# EAGLE design WeMos-Matrix-Shield-DMA-buffer (EAGLE 7.7.0)
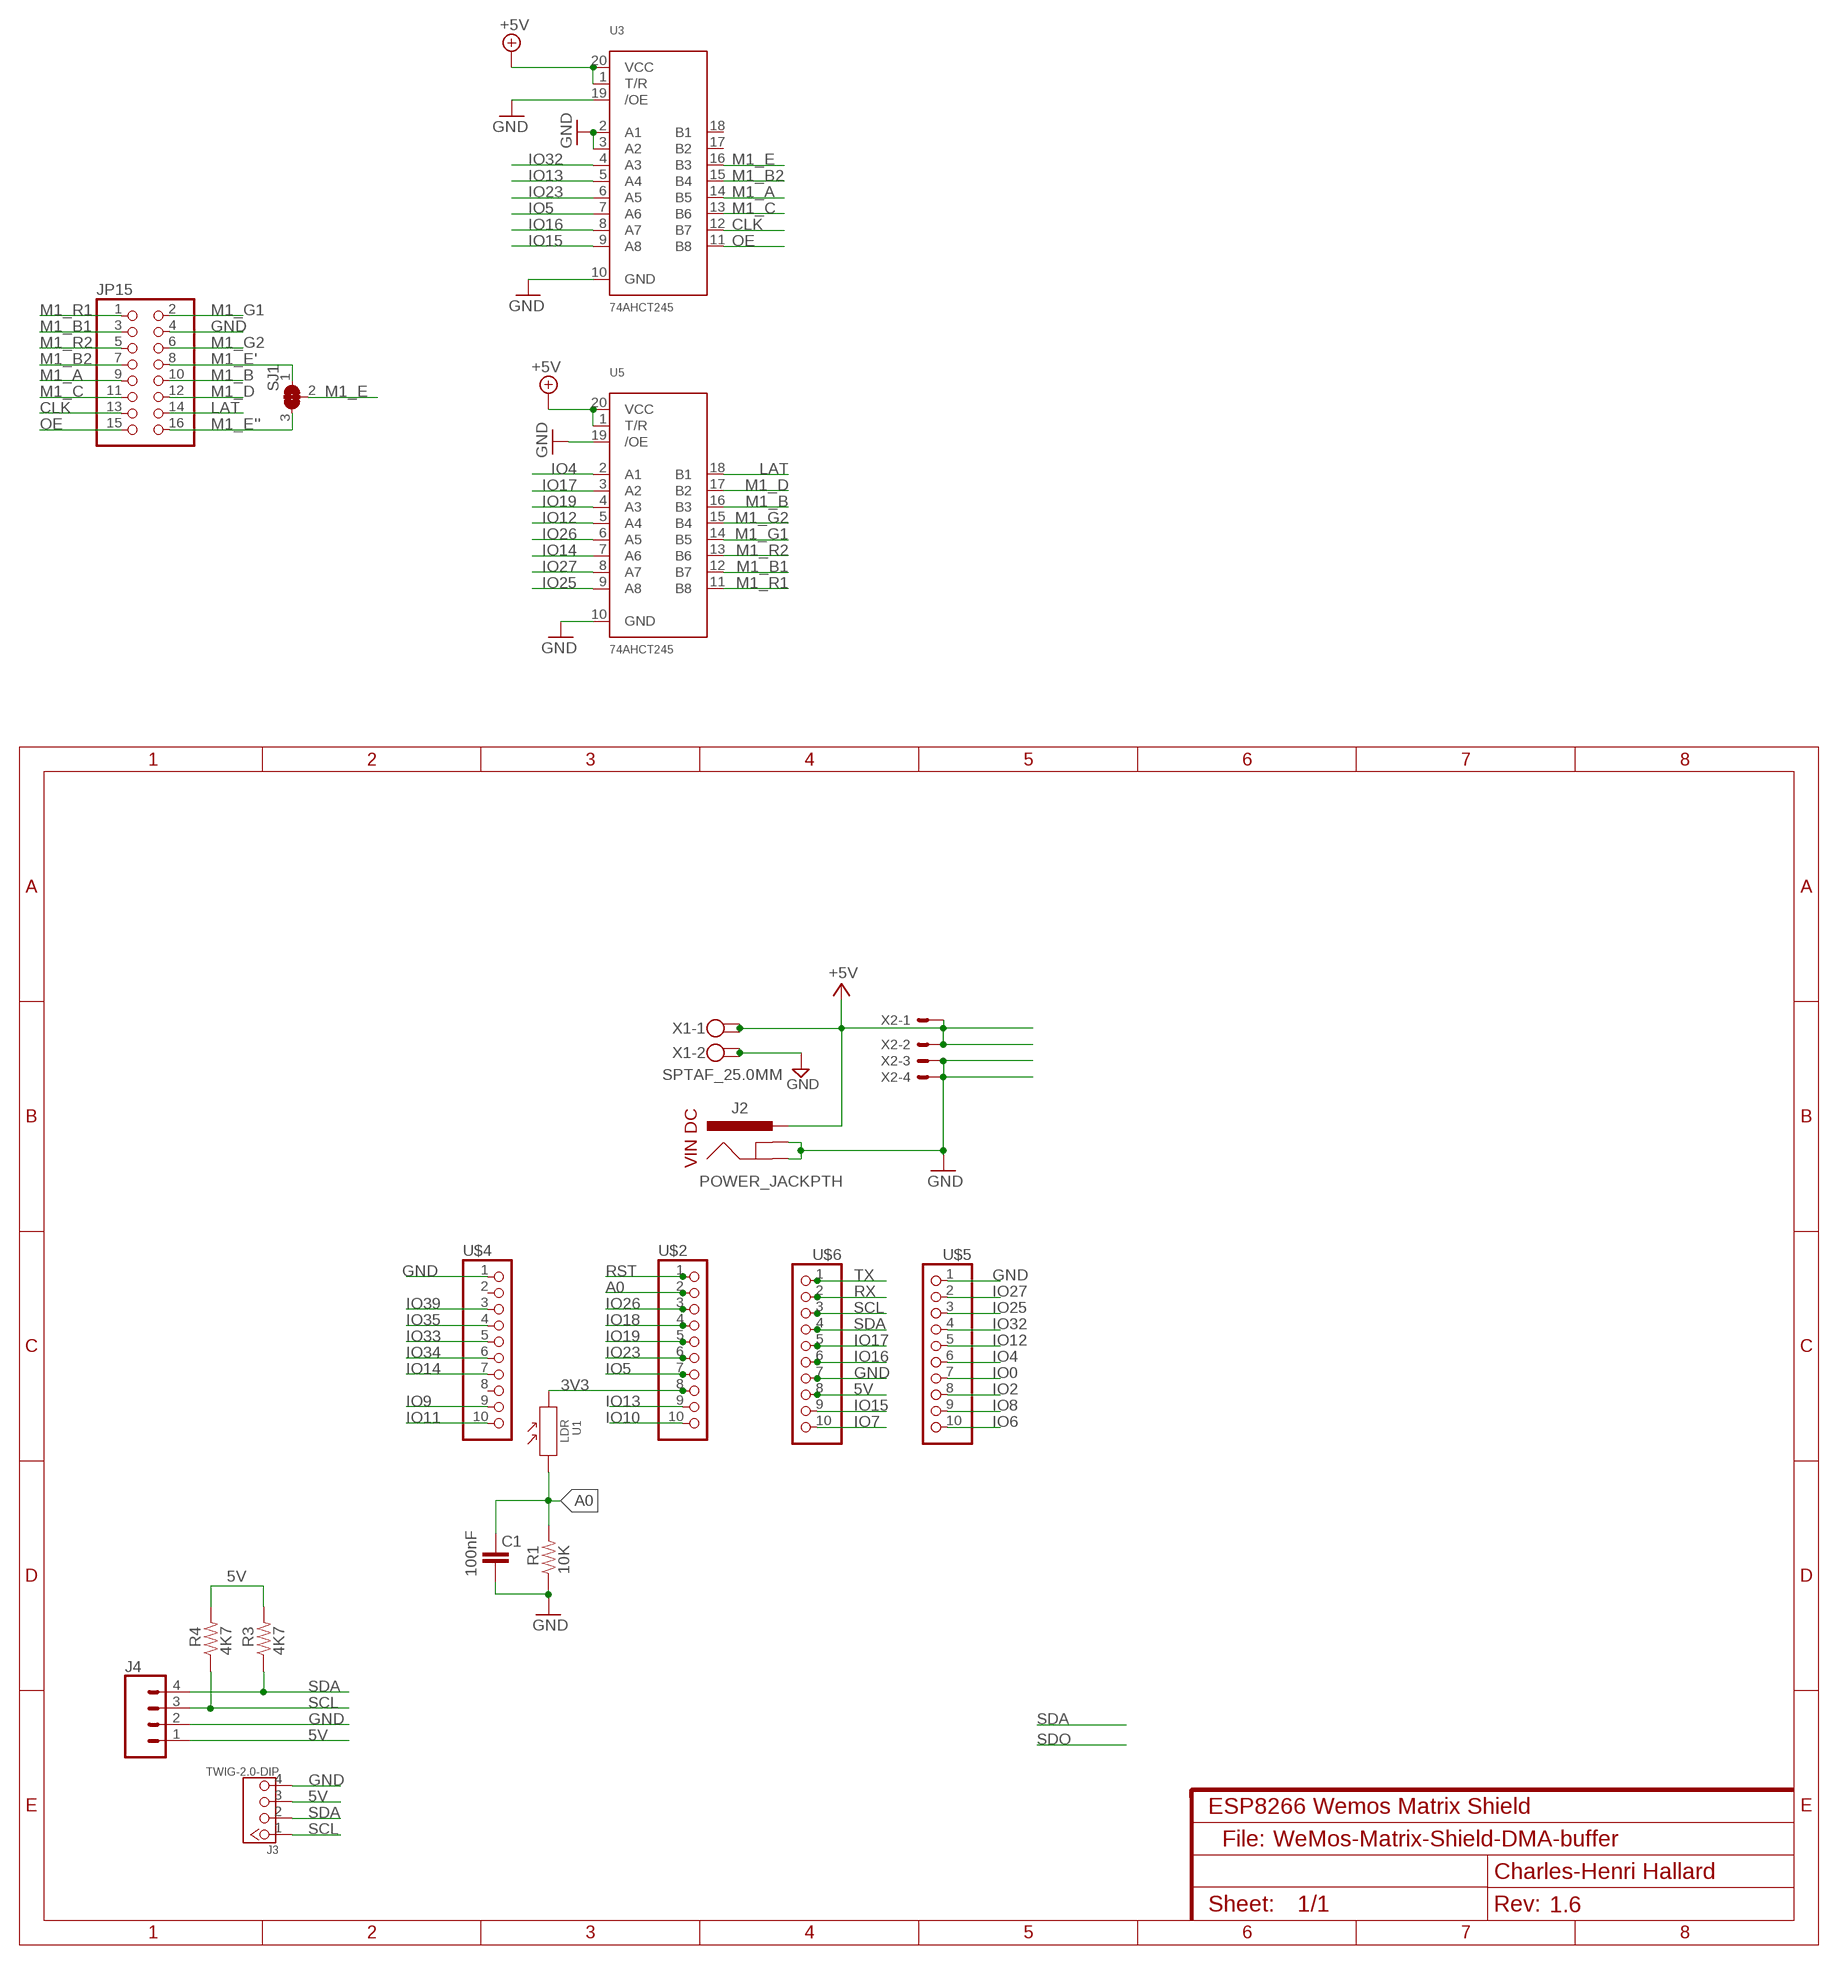
[diagram p0: schematic, sheet 1]
NAME (FRAME-A4L): CNAME: ESP8266 Wemos Matrix Shield; CREVISION: 1.6; DESIGNER: Charles-Henri Hallard

## Parts
C1  100nF  CAP0805-CAP  [0805-CAP]
J2  POWER_JACKPTH  [POWER_JACK_PTH]
J3  TWIG-2.0-DIP  [2.0_1X4]
J4  CONN_04  [1X04]
JP15  HEADER-2X8  [2X08]
R1  10K  RESISTOR0805-RES  [0805-RES]
R3  4K7  RESISTOR0805-RES  [0805-RES]
R4  4K7  RESISTOR0805-RES  [0805-RES]
SJ1  SOLDERJUMPER_2WAY  [SOLDERJUMPER_2WAY_OPEN_NOPASTE]
U1  LDR  PHOTORESISTOR-5528-10K(2P-5.0X4.2MM)  [SNR2-3.0]
U3  74AHCT245  74LCX245  [TSSOP20]
U5  74AHCT245  74LCX245  [TSSOP20]
U$2  PINHD-1X10  [1X10-BIG]
U$4  PINHD-1X10  [1X10-BIG]
U$5  PINHD-1X10  [1X10-BIG]
U$6  PINHD-1X10  [1X10-BIG]
X1  SPTAF_25.0MM  [SPTAF_2X50]
X2  KK-156-4  [KK-156-4]

## Nets
3V3: U1.2 U$2.8
5V: J2.PWR J3.3 J4.1 R3.2 R4.2 U3.1(T/R) U3.20(VCC) U5.1(T/R) U5.20(VCC) U$6.8 X1.1 X1.1A X2.1 X2.2 ; supply symbol labelled +5V
A0: C1.1 R1.2 U1.1 U$2.2
CLK: JP15.13 U3.12(B7)
GND: C1.2 J2.GND J2.GNDBREAK J3.4 J4.2 JP15.4 R1.1 U3.2(A1) U3.3(A2) U3.10(GND) U3.19(/OE) U5.10(GND) U5.19(/OE) U$4.1 U$5.1 U$6.7 X1.2 X1.2A X2.3 X2.4
IO0: U$5.7
IO2: U$5.8
IO4: U5.2(A1) U$5.6
IO5: U3.7(A6) U$2.7
IO6: U$5.10
IO7: U$6.10
IO8: U$5.9
IO9: U$4.9
IO11: U$4.10
IO12: U5.5(A4) U$5.5
IO13: U3.5(A4)
IO14: U5.7(A6) U$4.7
IO15: U3.9(A8) U$6.9
IO16: U3.8(A7) U$6.6
IO17: U5.3(A2) U$6.5
IO18: U$2.4
IO19: U5.4(A3) U$2.5
IO23: U3.6(A5) U$2.6
IO25: U5.9(A8) U$5.3
IO26: U5.6(A5) U$2.3
IO27: U5.8(A7) U$5.2
IO32: U3.4(A3) U$5.4
IO33: U$4.5
IO34: U$4.6
IO35: U$4.4
IO39: U$4.3
LAT: JP15.14 U5.18(B1)
M1_A: JP15.9 U3.14(B5)
M1_B: JP15.10 U5.16(B3)
M1_B1: JP15.3 U5.12(B7)
M1_B2: JP15.7 U3.15(B4)
M1_C: JP15.11 U3.13(B6)
M1_D: JP15.12 U5.17(B2)
M1_E: SJ1.2 U3.16(B3)
M1_E': JP15.8 SJ1.1
M1_E'': JP15.16 SJ1.3
M1_G1: JP15.2 U5.14(B5)
M1_G2: JP15.6 U5.15(B4)
M1_R1: JP15.1 U5.11(B8)
M1_R2: JP15.5 U5.13(B6)
OE: JP15.15 U3.11(B8)
RST: U$2.1
RX: U$6.2
SCL: J3.1 J4.3 R4.1 U$6.3
SDA: J3.2 J4.4 R3.1 U$6.4
TX: U$6.1
Unconnected: U3.17(B2) U3.18(B1) U$2.9 U$2.10 U$4.2 U$4.8

## Notes on the sheet
- VIN DC
- File:

## Library data of the parts
C1 = _c2h:CAP: Capacitor Standard 0603 ceramic capacitor, and 0.1" leaded capacitor.
J2 = SparkFun-Connectors:POWER_JACK: Power Jack This is the standard 5.5mm barrel jack for power. The PTH is the most common, proven, reliable, footprint. The Slot footprint only works if the mill layer is transmitted to the PCB fab house so be warned. Spark Fun Electronics SKU : PRT-00119 SMT: CONN-08106 Mating wall wart : TOL-00298 (and others)
J3 = Connector:TWIG-2.0-DIP
J4 = SparkFun-Connectors:CONN_04: Multi connection point. Often used as Generic Header-pin footprint for 0.1 inch spaced/style header connections On any of the 0.1 inch spaced packages, you can populate with these: Break Away Headers - Straight <https://www.sparkfun.com/products/116> (PRT-00116) Break Away Male Headers - Right Angle <https://www.sparkfun.com/products/553> (PRT-00553) Female Headers <https://www.sparkfun.com/products/115> (PRT-00115) Break Away Headers - Machine Pin <https://www.sparkfun.com/products/117> (PRT-00117) Break Away Female Headers - Swiss Machine Pin <https://www.sparkfun.com/products/743> (PRT-00743) For SCREWTERMINALS and SPRING TERMINALS visit here: Screw Terimnals on SparkFun.com <https://www.sparkfun.com/search/results?term=Screw+Terminals> (5mm/3.5mm/2.54mm spacing) This device is also useful as a general connection point to wire up your design to another part of your project. Our various solder wires solder well into these plated through hole pads. Hook-Up Wire - Assortment (Stranded, 22 AWG) <https://www.sparkfun.com/products/11375> (PRT-11375) Hook-Up Wire - Assortment (Solid Core, 22 AWG) <https://www.sparkfun.com/products/11367> (PRT-11367) View the entire wire category on our website here <https://www.sparkfun.com/categories/141> Special notes: Molex polarized connector foot print use with SKU : PRT-08231 with associated crimp pins and housings. 1MM SMD Version SKU: PRT-10208; PROD_ID: CONN-09696
JP15 = microbuilder:HEADER-2X8
R1 R3 R4 = _c2h:RESISTOR: Resistor Basic schematic elements and footprints for 0603, 1206, and PTH resistors.
SJ1 = microbuilder:SOLDERJUMPER_2WAY: 2-Way Solder Jumper
U1 = Seeed-Sensor:PHOTORESISTOR-5528-10K(2P-5.0X4.2MM): 314020017; MPN: PHOTORESISTOR-5528-10K; VALUE: PHOTORESISTOR-5528-10K
U3 U5 = microbuilder:74LCX245: 74LCX245MTC - 5.0V Tolerant Bi-Directional Buffer Can be used to interface 5.0V logic to 2.5 or 3.3V devices Digikey: 74LCX245MTCXTR-ND Mouser: 512-74LCX245MTCX
U$2 U$4-U$6 = adafruit:PINHD-1X10: Pin header 1x10 0.1" spacing With round pins
X1 = _c2h:SPTAF_2: PHOENIX
X2 = con-molex:KK-156-4: KK 156 HEADER Source: http://www.molex.com/pdm_docs/sd/026604100_sd.pdf; OC_FARNELL: unknown; OC_NEWARK: unknown

## Net classes
0 default: width 0.203 mm, drill 0.356 mm, clearance 0.152 mm
1 power: width 0.203 mm, clearance 0.152 mm

## Board
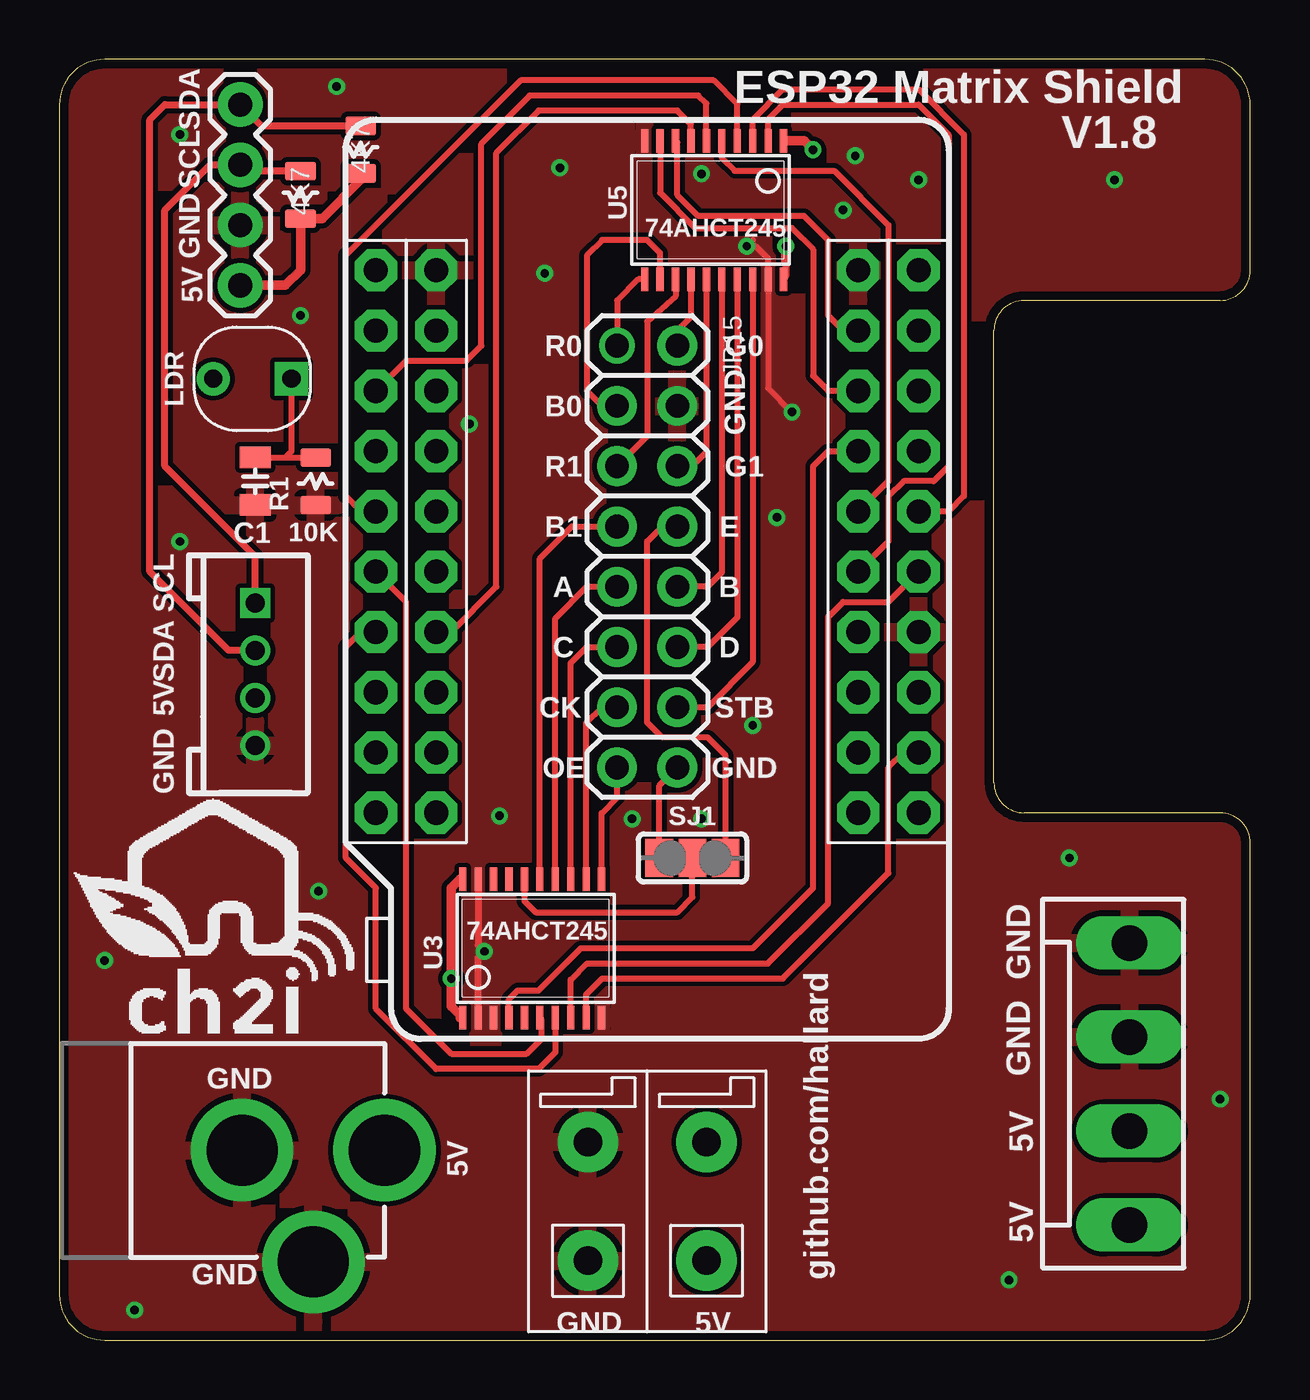
[diagram p1: board, top side]
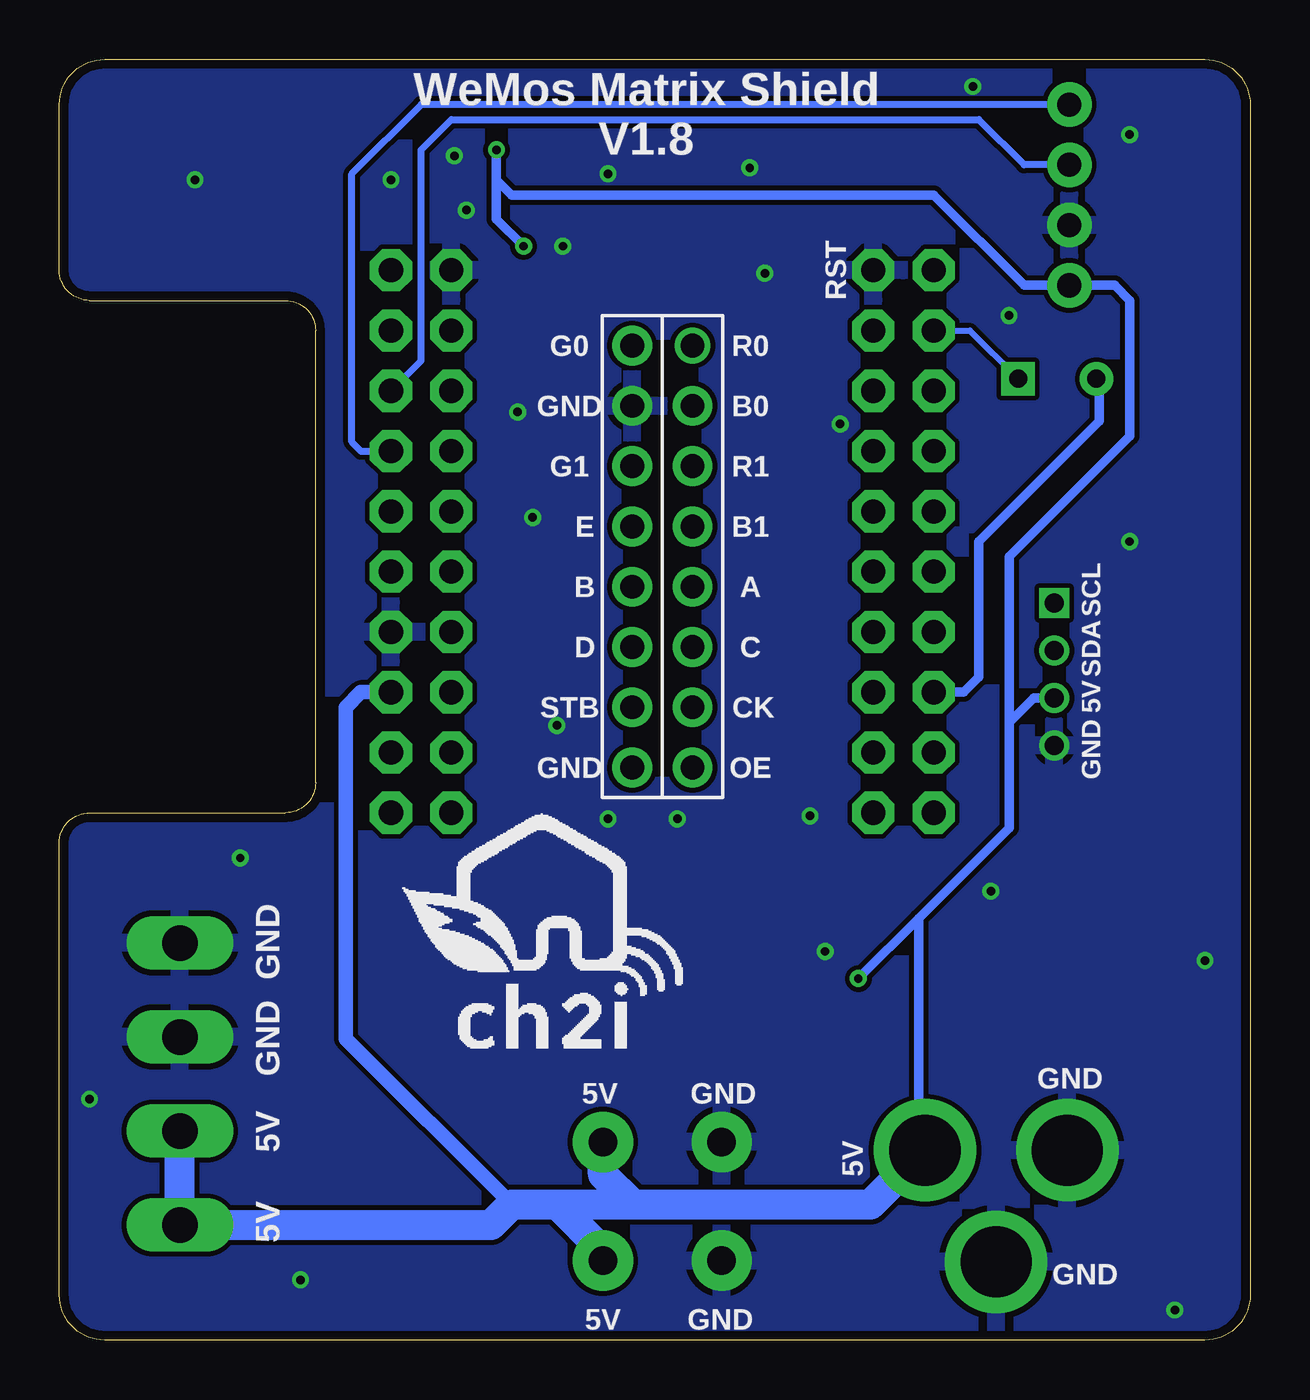
[diagram p2: board, bottom side, seen from below]

Size 50.16 x 53.98 mm. Coordinates in mm from the lower left corner, seen from the top.
Outline: 1.91,53.98 arc90 0,52.07 0,1.91 arc90 1.91,0 48.26,0 arc90 50.16,1.91 50.16,20.95 arc90 48.9,22.23 40.64,22.23 arc-90 39.37,23.5 39.37,42.55 arc-90 40.64,43.81 48.9,43.81 arc90 50.16,45.09 50.16,52.07 arc90 48.26,53.98 1.91,53.98
Copper layers (1*16): Top 0.035559375mm / dielectric 1.6mm / Bottom 0.035559375mm
Design rules "oshpark-2layer-tented": minimum track width 6mil, minimum drill 10mil, track to track 6mil, track to pad 6mil, pad to pad 6mil, via to via 6mil, smd to smd 6mil, copper to edge 15mil, drill to drill 6mil, minimum pad ring 5mil, minimum via ring 5mil, stop-mask expansion 2.5mil, vias tented up to drill 20mil, thermal gap 10mil

### Footprints (pad centres in the part's own frame; a part is rotated, then mirrored left to right if it is on the bottom)
0805-CAP = smd 0.902 x 1.3: 1 -1,0; 2 1,0
POWER_JACK_PTH = drill 2.997 pad 4.318: GND 0,7.7; GNDBREAK 4.7,10.7; PWR 0,13.7
2.0_1X4 = drill 0.8 pad 1.27 square: 1 -3,0 | drill 0.8 pad 1.27: 2 -1,0; 3 1,0; 4 3,0
1X04 = drill 1.016 pad 1.88: 1 0,0; 2 2.54,0; 3 5.08,0; 4 7.62,0
2X08 = drill 1: 1 -8.89,-1.27 | drill 1 pad 1.676: 2 -8.89,1.27; 3 -6.35,-1.27; 4 -6.35,1.27; 5 -3.81,-1.27; 6 -3.81,1.27; 7 -1.27,-1.27; 8 -1.27,1.27; 9 1.27,-1.27; 10 1.27,1.27; 11 3.81,-1.27; 12 3.81,1.27; 13 6.35,-1.27; 14 6.35,1.27; 15 8.89,-1.27; 16 8.89,1.27
0805-RES = smd 0.8 x 1.3: 1 -1,0; 2 1,0
SOLDERJUMPER_2WAY_OPEN_NOPASTE = smd 1.168 x 1.6: 1 -1.397,0; 2 0,0; 3 1.397,0
SNR2-3.0 = drill 0.762 pad 1.397 square: 1 -1.651,0 | drill 0.762 pad 1.397: 2 1.651,0
TSSOP20 = smd 0.305 x 0.991: 1 -3.075,-2.918; 2 -2.425,-2.918; 3 -1.775,-2.918; 4 -1.125,-2.918; 5 -0.475,-2.918; 6 0.175,-2.918; 7 0.825,-2.918; 8 1.475,-2.918; 9 2.125,-2.918; 10 2.775,-2.918; 11 2.775,2.918; 12 2.125,2.918; 13 1.475,2.918; 14 0.825,2.918; 15 0.175,2.918; 16 -0.475,2.918; 17 -1.125,2.918; 18 -1.775,2.918; 19 -2.425,2.918; 20 -3.075,2.918
1X10-BIG = drill 1.016 pad 1.778 octagon: 1 -11.43,0; 2 -8.89,0; 3 -6.35,0; 4 -3.81,0; 5 -1.27,0; 6 1.27,0; 7 3.81,0; 8 6.35,0; 9 8.89,0; 10 11.43,0
SPTAF_2X50 = drill 1.2 pad 2.54: 1 -2.5,-2; 1A -2.5,3; 2 2.5,-2; 2A 2.5,3
KK-156-4 = drill 1.5 pad 1.93 long: 1 -5.94,0; 2 -1.98,0; 3 1.98,0; 4 5.94,0

### Placement (x,y rotation side)
C1  8.26,36.2 270 top
J2  0,8 270 top
J3  8.26,28.07 270 top
J4  7.62,44.45 90 top
JP15  24.77,33.02 270 top
R1  10.79,36.2 90 top
R3  12.7,50.16 270 top
R4  10.16,48.26 270 top
SJ1  26.67,20.32 180 top
U1  8.13,40.51 180 top
U3  20.07,16.51 0 top
U5  27.43,47.62 180 top
U$1  [LOGO_CH2I_110MM]  29.21,15.24 0 bottom
U$2  13.33,33.66 270 top
U$3  [LOGO_CH2I_110MM]  7.11,15.88 0 top
U$4  15.87,33.66 270 top
U$5  33.66,33.66 270 top
U$6  36.2,33.66 270 top
X1  24.77,6.35 180 top
X2  45.09,10.79 90 top

### Tracks (layer width: path | path; a pad name or v marks a point on that pad's centre or on a via)
3V3
  Bottom 0.406: U$2.8 12.06,27.3 11.43,27.94 11.43,33.66 6.35,38.73 6.35,40.39 U1.2
5V  (via drill 0.36 pad 0.71)
  Top 0.254: U3.1 16.89,13.59 | U3.20 16.89,19.43
  Top 0.305: U5.1 30.6,50.54 30.61,50.55 | 30.61,45.47 30.61,44.86 U5.20
  Top 0.406: R3.2 12.7,48.9 11.06,47.26 R4.2 10.16,45.09 9.53,44.45 J4.1 | 30.61,50.55 31.37,50.55 v31.75,50.16 | v30.61,46.1 30.61,45.47 | 16.89,13.59 16.89,13.69 16.51,14.07 v16.51,15.24 16.51,19.05 16.89,19.43
  Bottom 0.406: v31.75,50.16 31.75,48.9 | 31.75,48.9 31.75,47.24 v30.61,46.1 | 31.75,48.9 31.12,48.26 13.33,48.26 9.53,44.45 J4.1 5.71,44.45 5.08,43.81 5.08,38.1 10.16,33.02 10.16,26.04 | J2.PWR 13.97,8.27 13.97,17.78 | 10.16,26.04 10.16,21.59 13.97,17.78 | 13.97,17.78 v16.51,15.24 | J3.3 9.13,27.07 10.16,26.04
  Bottom 0.61: U$6.8 37.47,27.3 38.1,26.67 38.1,12.7 31.12,5.71
  Bottom 1.27: 13.72,8 J2.PWR 15.99,5.71 25.99,5.71 | 25.99,5.71 27.27,6.99 X1.1 | 29.21,5.71 31.12,5.71 31.98,4.86 X2.1 X2.2 | 29.21,5.71 25.99,5.71 | X1.1A 27.27,3.77 29.21,5.71
A0
  Top 0.254: C1.1 9.53,37.2 | 9.53,37.2 R1.2 | U1.1 9.78,37.45 9.53,37.2
  Bottom 0.254: U$2.2 11.81,42.55 U1.1
CLK
  Top 0.254: JP15.13 22.86,26.67 22.19,26 U3.12
GND  (via drill 0.36 pad 0.71)
  Top 0.254: v30.86,39.12 29.86,40.12 U5.19 29.86,45.58 29.34,46.1 v28.96,46.1 29.21,46.35
  Top 0.305: U3.2 17.64,16.12 v17.91,16.38 17.64,16.65 U3.19
  other vias: 40.01,2.54 3.18,1.27 44.45,48.9 1.91,16 48.9,10.16 42.55,20.32 18.54,22.1 10.92,18.92 11.68,52.83 21.08,49.4 29.21,25.91 5.08,33.66 30.23,34.67 24.13,21.97 27.05,21.97 20.45,44.96 17.27,38.61 33.02,47.62 27.05,49.15 10.16,43.18 5.08,50.8 33.53,49.91 36.2,48.9
  pour Top (isolate 0.203): 51.44,63.5 -1.27,63.5 -1.27,-1.27 51.44,-1.27
  pour Bottom (isolate 0.203): 50.8,-0.64 50.8,62.87 -0.63,62.87 -0.63,-0.64
IO4
  Top 0.254: U5.2 29.86,51.42 29.84,51.44 30.48,52.07 36.2,52.07 37.47,50.8 37.47,36.83 36.83,36.2 35.56,36.2 34.93,35.56 34.93,33.66 U$5.6
IO5
  Top 0.254: U$2.7 12.7,29.84 12.06,29.21 12.06,20.32 13.33,19.05 13.33,13.97 15.87,11.43 20.19,11.43 20.89,12.13 U3.7
IO12
  Top 0.254: U5.5 27.91,49.82 28.45,49.28 32.64,49.28 34.93,46.99 34.93,36.2 U$5.5
IO14
  Top 0.254: U5.7 26.61,51.24 26.03,51.82 20.19,51.82 18.41,50.04 18.41,31.75 16.51,29.84 U$4.7
IO15
  Top 0.254: U3.9 22.19,14.57 22.86,15.24 30.48,15.24 34.93,19.68 34.93,24.13 35.56,24.77 U$6.9
IO16
  Top 0.254: U3.8 21.54,15.19 22.23,15.88 29.84,15.88 32.39,18.41 32.39,30.48 33.02,31.11 34.93,31.11 U$6.6
IO17
  Top 0.254: U5.3 29.21,51.43 30.48,52.7 36.2,52.7 38.1,50.8 38.1,35.56 37.47,34.92 U$6.5
IO19
  Top 0.254: U5.4 28.56,52.09 27.56,53.09 19.43,53.09 12.06,45.72 12.06,35.56 12.7,34.92 U$2.5
IO23
  Top 0.254: 20.24,13.26 U3.6 20.32,13.51 20.32,12.7 19.69,12.06 16.51,12.06 14.6,13.97 14.6,31.11 U$2.6
IO25
  Top 0.254: U5.9 25.31,48.35 26.8,46.86 30.86,46.86 31.75,45.97 31.75,40.64 32.39,40.01 U$5.3
IO26
  Top 0.254: U5.6 27.26,52.12 26.92,52.45 19.81,52.45 17.78,50.42 17.78,41.91 17.15,41.27 14.6,41.27 U$2.3
IO27
  Top 0.254: U$5.2 33.02,42.55 32.39,43.18 32.39,46.35 31.37,47.37 26.92,47.37 26.03,48.26 26.03,50.47 U5.8
IO32
  Top 0.254: U$5.4 32.39,37.47 31.75,36.83 31.75,19.05 29.21,16.51 21.97,16.51 20.19,14.73 19.3,14.73 18.94,14.37 U3.4
LAT
  Top 0.254: U5.18 29.21,28.57 27.3,26.67 JP15.14
M1_A
  Top 0.254: JP15.9 22.23,31.75 20.89,30.42 U3.14
M1_B
  Top 0.254: U5.16 27.91,32.35 27.3,31.75 JP15.10
M1_B1
  Top 0.254: U5.12 25.31,45.81 24.77,46.35 22.86,46.35 22.23,45.72 22.23,40.01 22.86,39.37 JP15.3
M1_B2
  Top 0.254: JP15.7 21.59,34.29 20.24,32.94 U3.15
M1_C
  Top 0.254: JP15.11 22.23,29.21 21.54,28.53 U3.13
M1_D
  Top 0.254: U5.17 28.56,30.46 27.3,29.21 JP15.12
M1_E
  Top 0.254: U3.16 19.59,18.51 20.07,18.03 26.03,18.03 26.67,18.67 SJ1.2
M1_E'
  Top 0.254: SJ1.1 28.07,24.64 27.3,25.4 25.4,25.4 24.77,26.04 24.77,33.66 25.4,34.29 JP15.8
M1_E''
  Top 0.254: 25.91,24 JP15.16 25.27,23.37 SJ1.3
M1_G1
  Top 0.254: U5.14 26.61,43.12 26.03,42.55 JP15.2
M1_G2
  Top 0.254: U5.15 27.26,37.42 26.67,36.83 JP15.6
M1_R1
  Top 0.254: U5.11 24.39,44.71 23.49,43.81 JP15.1
M1_R2
  Top 0.254: U5.13 25.96,43.99 24.77,42.93 24.77,38.1 JP15.5
OE
  Top 0.254: U3.11 22.84,22.21 23.49,22.86 JP15.15
SCL
  Top 0.254: 7.89,49.26 J4.3
  Top 0.305: R4.1 7.89,49.26 | J4.3 6.35,49.53 4.45,47.62 4.45,36.83 8.26,33.02 J3.1
  Bottom 0.305: J4.3 9.53,49.53 11.43,51.44 33.66,51.44 34.93,50.16 34.93,41.27 U$6.3
SDA
  Top 0.305: R3.1 8.53,51.16 J4.4 4.45,52.07 3.81,51.44 3.81,32.38 7.13,29.07 J3.2
  Bottom 0.305: U$6.4 37.47,37.47 37.85,37.85 37.85,49.15 34.93,52.07 J4.4

### Text on the board
tPlace: github.com/hallard
tNames: ESP32 Matrix Shield | SDA | V1.8 | SCL | GND | 5V | R0 | G0 | GND | B0 | R1 | G1 | B1 | E | SCL | A | B | SDA | C | D | 5V | CK | STB | GND | OE | GND | GND | GND | GND | 5V | 5V | 5V | GND | GND | 5V
bNames: WeMos Matrix Shield / V1.8 | RST | R0 | G0 | B0 | GND | R1 | G1 | B1 | E | SCL | A | B | SDA | C | D | 5V | CK | STB | GND | OE | GND | GND | GND | GND | GND | 5V | 5V | 5V | 5V | GND | GND | 5V